# EAGLE design femtoduinoUSB (EAGLE 6.5.0)
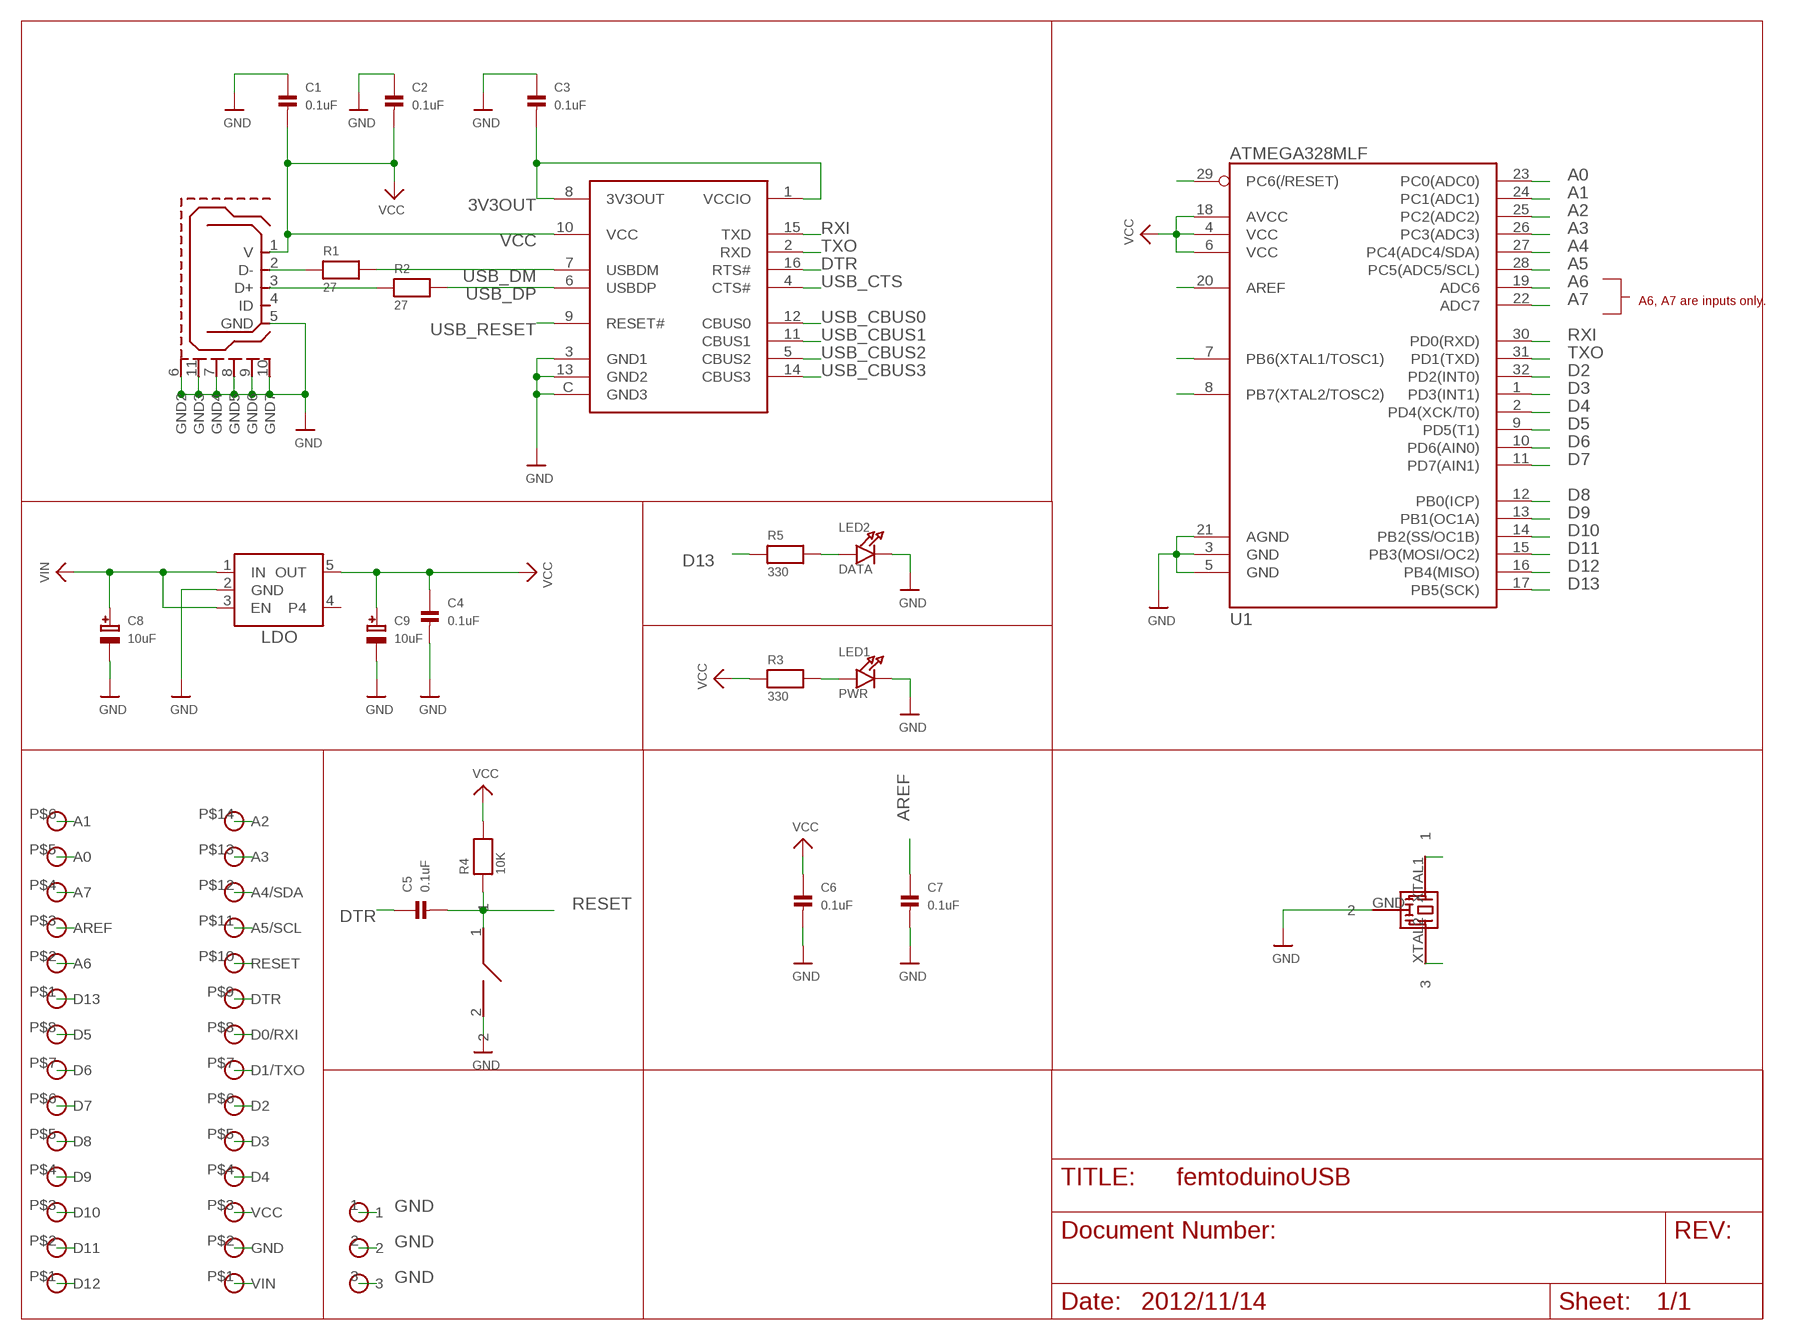
[diagram p0: schematic, sheet 1]
FRAME1 (LETTER_L): LAST_DATE_TIME: 2012/11/14

## Parts
C1  0.1uF  CAP_CERAMIC_0402MP  [_0402MP]
C2  0.1uF  CAP_CERAMIC_0402MP  [_0402MP]
C3  0.1uF  CAP_CERAMIC_0402MP  [_0402MP]
C4  0.1uF  CAP_CERAMIC_0402MP  [_0402MP]
C5  0.1uF  CAP_CERAMIC_0402MP  [_0402MP]
C6  0.1uF  CAP_CERAMIC_0402MP  [_0402MP]
C7  0.1uF  CAP_CERAMIC_0402MP  [_0402MP]
C8  10uF  CAP_TANTALUMA/3216_REFLOW  [EIA3216-18/A-R]
C9  10uF  CAP_TANTALUMA/3216_REFLOW  [EIA3216-18/A-R]
LED1  PWR  LED0603_NOOUTLINE  [CHIPLED_0603_NOOUTLINE]
LED2  DATA  LED0603_NOOUTLINE  [CHIPLED_0603_NOOUTLINE]
R1  27  RESISTOR_0402MP  [_0402MP]
R2  27  RESISTOR_0402MP  [_0402MP]
R3  330  RESISTOR_0402MP  [_0402MP]
R4  10K  RESISTOR_0402  [_0402]
R5  330  RESISTOR_0402MP  [_0402MP]
U1  ATMEGA328MLF  ATMEGA168MLF  [MLF32]
U$1  FT230XQ  [FT230XQ]
U$2  05_PINHEAD_1X6  [05_PINHEAD_1X6_PACKAGE]
U$3  05_PINHEAD_1X8  [05_PINHEAD_1X8_PACKAGE]
U$4  05_PINHEAD_1X14  [05_PINHEAD_1X14_PACKAGE]
U$6  USB_MICROB  [USB_MICROB_PACKAGE]
U$10  LDO_REGULATOR  [LDO_REGULATOR]
U$17  SPST_SMD  [SPST_SMD]
U$22  CSTCE16MOV51-RO  [CSTCE16M0V51-RO_PACKAGE]
U$28  05_PINHEAD_HEADER_1X3  [05_PINHEAD_1X3_HEAD_PACKAGE]

## Nets
3V3OUT: C3.2 U$1.1(VCCIO) U$1.8(3V3OUT)
A0: U1.23(PC0(ADC0)) U$2.P$5(A0)
A1: U1.24(PC1(ADC1)) U$2.P$6(A1)
A2: U1.25(PC2(ADC2)) U$4.P$14(A2)
A3: U1.26(PC3(ADC3)) U$4.P$13(A3)
A4: U1.27(PC4(ADC4/SDA)) U$4.P$12(A4/SDA)
A5: U1.28(PC5(ADC5/SCL)) U$4.P$11(A5/SCL)
A6: U1.19(ADC6) U$2.P$2(A6)
A7: U1.22(ADC7) U$2.P$4(A7)
AREF: C7.1 U1.20(AREF) U$2.P$3(AREF)
D2: U1.32(PD2(INT0)) U$4.P$6(D2)
D3: U1.1(PD3(INT1)) U$4.P$5(D3)
D4: U1.2(PD4(XCK/T0)) U$4.P$4(D4)
D5: U1.9(PD5(T1)) U$3.P$8(D5)
D6: U1.10(PD6(AIN0)) U$3.P$7(D6)
D7: U1.11(PD7(AIN1)) U$3.P$6(D7)
D8: U1.12(PB0(ICP)) U$3.P$5(D8)
D9: U1.13(PB1(OC1A)) U$3.P$4(D9)
D10: U1.14(PB2(SS/OC1B)) U$3.P$3(D10)
D11: U1.15(PB3(MOSI/OC2)) U$3.P$2(D11)
D12: U1.16(PB4(MISO)) U$3.P$1(D12)
D13: R5.1 U1.17(PB5(SCK)) U$2.P$1(D13)
DTR: C5.1 U$1.16(RTS#) U$4.P$9(DTR)
GND: C1.1 C2.1 C3.1 C4.2 C6.2 C7.2 C8.- C9.- LED1.C LED2.C U1.3(GND) U1.5(GND) U1.21(AGND) U$1.3(GND1) U$1.13(GND2) U$1.C(GND3) U$4.P$2(GND) U$6.5(GND) U$6.6(GND2) U$6.7(GND4) U$6.8(GND5) U$6.9(GND6) U$6.10(GND7) U$6.11(GND3) U$10.2(GND) U$17.2 U$22.GND U$28.1 U$28.2 U$28.3
N$1: R1.1 U$6.2(D-)
N$2: R2.1 U$6.3(D+)
N$3: LED2.A R5.2
N$8: LED1.A R3.2
RESET: C5.2 R4.1 U1.29(PC6(/RESET)) U$4.P$10(RESET) U$17.1
RXI: U1.30(PD0(RXD)) U$1.15(TXD) U$4.P$8(D0/RXI)
TXO: U1.31(PD1(TXD)) U$1.2(RXD) U$4.P$7(D1/TXO)
USB_CBUS0: U$1.12(CBUS0)
USB_CBUS1: U$1.11(CBUS1)
USB_CBUS2: U$1.5(CBUS2)
USB_CBUS3: U$1.14(CBUS3)
USB_CTS: U$1.4(CTS#)
USB_DM: R1.2 U$1.7(USBDM)
USB_DP: R2.2 U$1.6(USBDP)
USB_RESET: U$1.9(RESET#)
VCC: C1.2 C2.2 C4.1 C6.1 C9.+ R3.1 R4.2 U1.4(VCC) U1.6(VCC) U1.18(AVCC) U$1.10(VCC) U$4.P$3(VCC) U$6.1(V) U$10.5(OUT)
VIN: C8.+ U$4.P$1(VIN) U$10.1(IN) U$10.3(EN)
XTAL1: U1.7(PB6(XTAL1/TOSC1)) U$22.XTAL1
XTAL2: U1.8(PB7(XTAL2/TOSC2)) U$22.XTAL2
Unconnected: U$6.4(ID) U$10.4

## Notes on the sheet
- A6, A7 are inputs only.

## Library data of the parts
C1-C7 = microbuilder:CAP_CERAMIC: Ceramic Capacitors 0402 - 0402 Surface Mount Capacitors 16pF 50V 5% [Digikey: 445-4899-2-ND] 18pF 50V 5% [Digikey: 490-1281-2-ND] 22pF 50V 5% [Digikey: 490-1283-2-ND] 68pF 50V 5% [Digikey: 490-1289-2-ND] 0.1uF 10V 10% [Digikey: 490-1318-2-ND] 1.0uF 6.3V 10% [Digikey: 490-1320-2-ND] 0603 - 0603 Surface Mount Capacitors 16 pF 50V 5% [Digikey: 445-5051-2-ND] 22 pF 50V [Digikey: PCC220ACVTR-ND] 33 pF 50V 5% [Digikey: 490-1415-1-ND] 56pF 50V 5% [Digikey: 490-1421-1-ND] 220pF 50V 5% [Digikey: 445-1285-1-ND] 680 pF 50V 2200 pF 50V 5% C0G [Digikey: 445-1297-1-ND] 5600 pF 100V 5% X7R [Digikey: 478-3711-1-ND] 0.1 µF 25V 10% [Digikey: PCC2277TR-ND] 0.22 µF 16V 10% X7R [Digikey: 445-1318-1-ND] 1.0 µF 25V 10% [Digikey: 445-5146-2-ND] 0603 - RF Specific 3pF 250V +/-0.1pF RF [Digikey: 712-1347-1-ND] 18 pF 250V 5% [Digikey: 478-3505-1-ND or 712-1322-1-ND] 56 pF 250V 5% C0G RF [Digikey: 490-4867-1-ND] 68 pF 250V RF [Digikey: 490-4868-1-ND] 0805 - 0805 Surface Mount Capacitors 220 pF 250V 2% RF Ceramic Capacitor [Digikey: 712-1398-1-ND] 1000 pF 50V 2% NP0 Ceramic Capacitor [Digikey: 478-3760-1-ND] 0.1 µF 25V 10% Ceramic Capacitor [Digikey: PCC1828TR-ND] 1.0 µF 16V 10% Ceramic Capacitor[Digikey: 490-1691-2-ND] 10.0 µF 10V 10% Ceramic Capacitor[Digikey: 709-1228-1-ND] 10.0 uF 16V 10% Ceramic Capacitor [Digikey: 478-5165-2-ND] 47 uF 6.3V 20% Ceramic Capacitor [Digikey: 587-1779-1-ND or 399-5506-1-ND] 1206 - 1206 Surface Mount Capacitors 47uF 10V 20% Ceramic Capacitor [Digikey: 490-5528-1-ND or 399-5508-1-ND or 445-6010-1-ND] 100uF 6.3V -20%, +80% Y5V Ceramic Capacitor (Digikey: 490-4512-1-ND, Mouser: 81-GRM31CF50J107ZE1L)
C8 C9 = microbuilder:CAP_TANTALUM: Tantalum Capacitors Wave footprints have larger pads and are meant to be used for hand soldering. Reflow footprints are optimised for solder paste and a reflow oven. EIA3216-18/A-[R/W] - Size A / 3216-18 / 1206 footprint 4.7µF 25V 10% Tantalum Capacitor 10µF 16V 10% Tantalum Capacitor [Digikey: 495-2236-2-ND] EIA3528-21/B-[R/W] - Size B / 3528-21 47µF 10V 10% Tantalum Capactior [Digikey: 495-2216-1-ND] EIA6032-28/C-[R/W] - Size C / 6032-28 10µF 35V 20% Tantalum Capacitor [Digikey: 495-2285-1-ND] 100µF 16V 10% Tantalum Capactior [Digikey: 399-5214-1-ND]
LED1 LED2 = microbuilder:LED: LED 0603 - 0603 Surface Mount Package 2mA: Green LED - Low Power (3.9mcd, 2ma, 1.7Vf) - Digikey: 475-2709-2-ND Orange LED - Low Power (9.8mcd, 2ma, 1.8Vf) - Digikey: 475-1194-2-ND Red LED - Low Power (5mcd, 2ma, 1.8Vf) - Digikey: 475-1195-2-ND Yellow LED - Low Power (7mcd, 2ma, 1.8Vf) - Digikey: 475-1196-2-ND 5mA: Blue LED - Low Power (17mcd, 5ma, 2.9Vf) - Digikey: LNJ937W8CRACT-ND 0805 - 0805 Surface Mount Package 2mA: Red LED (8.8mcd, 2mA, 1.8Vf, Clear) - Low Power [Digikey: 475-2510-1-ND] Green LED (5mcd, 2mA, 1.8Vf, Clear) - Low Power [Digikey: 475-2730-1-ND] Yellow LED (11.3mcd, 2mA, 1.8Vf, Clear) - Low Power [Digikey: 475-2555-1-ND] 20mA: Red LED (104mcd, 20mA, Diffused) - LS R976 [Digikey: 475-1278-6-ND] Red LED (12mcd, 20mA, 2.0Vf, Clear) - APT2012EC [Digikey: 754-1128-1-ND] Green LED (15mcd, 20mA, 2.2Vf, Clear) - APT2012GC [Digikey: 754-1131-1-ND] Orange LED (160mcd, 20mA, 2.1Vf, Clear) - APT2012SECK [Digikey: 754-1130-1-ND] 1206 - 1206 Surface Mount Package Green LED (26mcd, 20mA, Diffused) - LG N971 [Digikey: 475-1407-6-ND] Red LED (15mcd, 20mA, Diffused) - LH N974 [Digikey: 475-1416-6-ND]
R1-R5 = microbuilder:RESISTOR: Resistors 0402 - 0402 Surface Mount Package 22 Ohm 1% 1/16W [Digikey: 311-22.0LRTR-ND] 33 Ohm 5% 1/16W 1.0K 5% 1/16W 1.5K 5% 1/16W 2.0K 1% 1/16W 10.0K 1% 1/16W [Digikey: 311-10.0KLRTR-ND] 10.0K 5% 1/16W [Digikey: RMCF0402JT10K0TR-ND] 12.1K 1% 1/16W [Digikey: 311-22.0LRTR-ND] 100.0K 5% 1/16W 0603 - 0603 Surface Mount Package 0 Ohm 1/10 Watt 1% Resistor 15 Ohm 1/10 Watt 1% Resistor 33 Ohm 1/10 Watt 1% Resistor 49.9 Ohm 1/10 Watt 1% Resistor 100 Ohm 1/10 Watt 1% Resistor 150 Ohm 1/10 Watt 1% Resistor 240 Ohm 1/10 Watt 1% Resistor 390 Ohm 1/10 Watt 1% Resistor 560 Ohm 1/10 Watt 1% Resistor 680 Ohm 1/10 Watt 1% Resistor 750 Ohm 1/10 Watt 1% Resistor 1.0K Ohm 1/10 Watt 1% Resistor 1.5K Ohm 1/10 Watt 1% Resistor 2.0K Ohm 1/10 Watt 1% Resistor 2.2K Ohm 1/10 Watt 1% Resistor 3.3K Ohm 1/10 Watt 1% Resistor 4.7K Ohm 1/10 Watt 1% Resistor 10.0K Ohm 1/10 Watt 1% Resistor 12.0K Ohm 1/10 Watt 1% Resistor 12.1K Ohm 1/10 Watt 1% Resistor 20.0K Ohm 1/10 Watt 1% Resistor 33.0K Ohm 1/10 Watt 1% Resistor 100.0K Ohm 1/10 Watt 1% Resistor 0805 - 0805 Surface Mount Package 0 Ohm 1/8 Watt 1% Resistor 33 Ohm 1/8 Watt 1% Resistor 100 Ohm 1/8 Watt 1% Resistor 150 Ohm 1/8 Watt 1% Resistor 200 Ohm 1/8 Watt 1% Resistor 240 Ohm 1/8 Watt 1% Resistor 330 Ohm 1/8 Watt 1% Resistor 390 Ohm 1/8 Watt 1% Resistor 470 Ohm 1/8 Watt 1% Resistor 1.0K Ohm 1/8 Watt 1% Resistor 1.5K Ohm 1/8 Watt 1% Resistor 2.0K Ohm 1/8 Watt 1% Resistor 4.7K Ohm 1/8 Watt 1% Resistor 5.1K Ohm 1/8 Watt 1% Resistor 5.6K Ohm 1/8 Watt 1% Resistor 10.0K Ohm 1/8 Watt 1% Resistor 22.0K Ohm 1/8 Watt 1% Resistor 33.0K Ohm 1/8 Watt 1% Resistor 100K Ohm 1/8 Watt 1% Resistor 1206 - 1206 Surface Mount Package 2012 - 2010 Surface Mount Package 0.11 Ohm 1/2 Watt 1% Resistor - Digikey: RHM.11UCT-ND
U1 = SparkFun-DigitalIC:ATMEGA168: Atmel 32-pin 8-bit micro, 16k flash.
U$1 = femtoduino:FT230XQ
U$2 = femtoduino:05_PINHEAD_1X6
U$3 = femtoduino:05_PINHEAD_1X8
U$4 = femtoduino:05_PINHEAD_1X14
U$6 = femtoduino:USB_MICROB: This is the hirose ZX62-B-5PA(11) MICRO-USB B Type female connection.
U$10 = femtoduino:LDO_REGULATOR
U$17 = femtoduino:SPST_SMD
U$22 = femtoduino:CSTCE16MOV51-RO: This is the CSTCE16M0V51-R0 Murata resonator (CERALOCK) 16Mhz 0.5% Tolerance
U$28 = femtoduino:05_PINHEAD_HEADER_1X3

## Net classes
0 default: clearance 0.205 mm

## Board
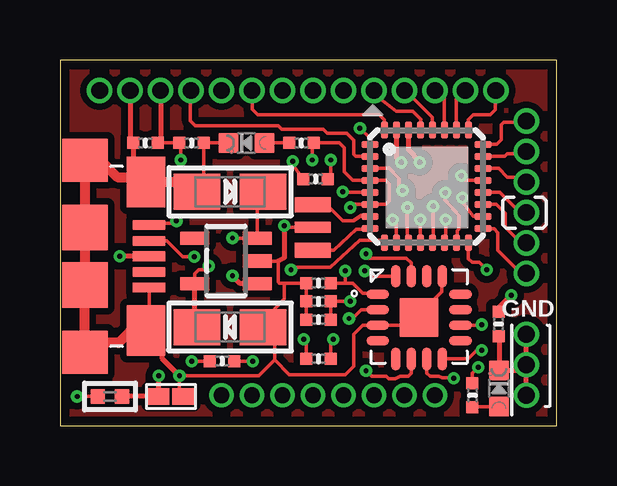
[diagram p1: board, top side]
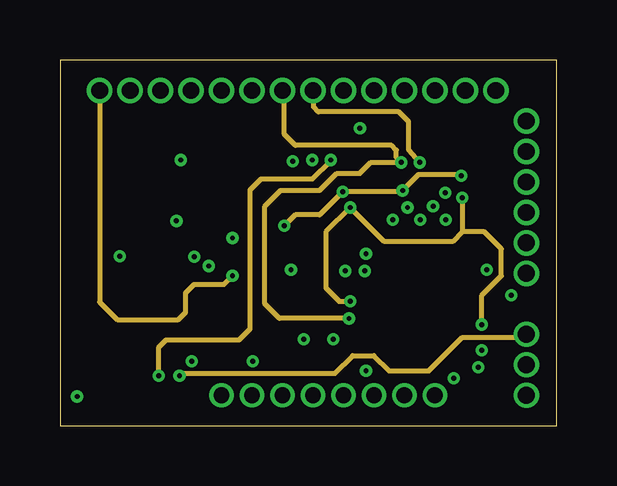
[diagram p2: board, inner layer Route2]
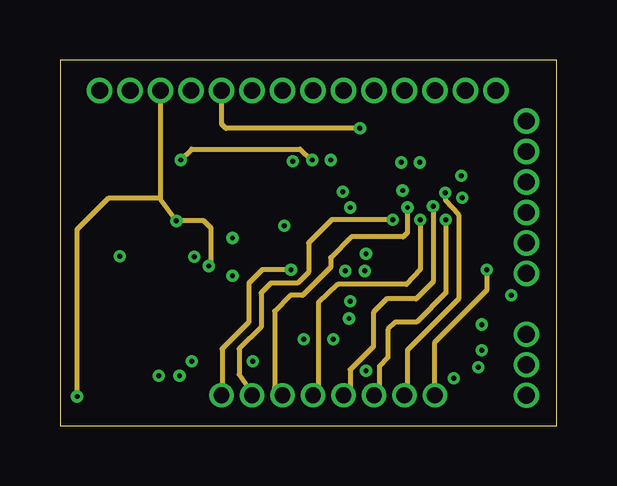
[diagram p3: board, inner layer Route15]
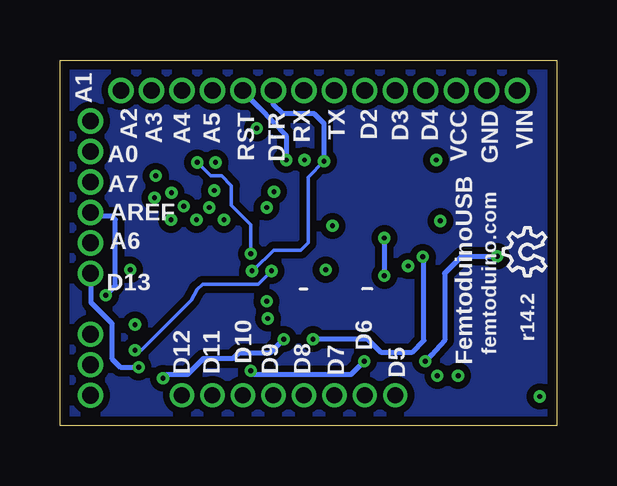
[diagram p4: board, bottom side, seen from below]

Size 20.7 x 15.24 mm. Coordinates in mm from the lower left corner, seen from the top.
Outline: 0,0 20.7,0 20.7,15.24 0,15.24 0,0
Copper layers (1+2*15+16): Top 0.035mm / dielectric 0.7mm / Route2 0.035mm / dielectric 0.15mm / Route15 0.035mm / dielectric 0.2mm / Bottom 0.035mm
Design rules "AQS_custom_4layer *": minimum track width 5mil, minimum drill 5mil, track to track 5mil, track to pad 5mil, pad to pad 5mil, via to via 5mil, smd to smd 1mil, copper to edge 15mil, drill to drill 6mil, minimum pad ring 7mil, minimum via ring 3mil, stop-mask expansion 2mil, vias tented up to drill 10mil, thermal gap 10mil

### Footprints (pad centres in the part's own frame; a part is rotated, then mirrored left to right if it is on the bottom)
_0402MP = smd 0.5 x 0.5: 1 -0.508,0; 2 0.508,0
EIA3216-18/A-R = smd 1.95 x 1.5: + 1.375,0; - -1.375,0
CHIPLED_0603_NOOUTLINE = smd 0.8 x 0.8: A 0,-0.75; C 0,0.75
_0402 = smd 0.6 x 0.6: 1 -0.508,0; 2 0.508,0
MLF32 = smd 0.7 x 0.3: 1 -2.35,1.75; 2 -2.35,1.25; 3 -2.35,0.75; 4 -2.35,0.25; 5 -2.35,-0.25; 6 -2.35,-0.75; 7 -2.35,-1.25; 8 -2.35,-1.75; 17 2.35,-1.75; 18 2.35,-1.25; 19 2.35,-0.75; 20 2.35,-0.25; 21 2.35,0.25; 22 2.35,0.75; 23 2.35,1.25; 24 2.35,1.75 | smd 0.3 x 0.7: 9 -1.75,-2.35; 10 -1.25,-2.35; 11 -0.75,-2.35; 12 -0.25,-2.35; 13 0.25,-2.35; 14 0.75,-2.35; 15 1.25,-2.35; 16 1.75,-2.35; 25 1.75,2.35; 26 1.25,2.35; 27 0.75,2.35; 28 0.25,2.35; 29 -0.25,2.35; 30 -0.75,2.35; 31 -1.25,2.35; 32 -1.75,2.35
FT230XQ = smd 0.95 x 0.4: 1 -1.725,0.975; 2 -1.725,0.325; 3 -1.725,-0.325; 4 -1.725,-0.975; 9 1.725,-0.975; 10 1.725,-0.325; 11 1.725,0.325; 12 1.725,0.975 | smd 0.4 x 0.95: 5 -0.975,-1.725; 6 -0.325,-1.725; 7 0.325,-1.725; 8 0.975,-1.725; 13 0.975,1.725; 14 0.325,1.725; 15 -0.325,1.725; 16 -0.975,1.725 | smd 1.6 x 1.6: C 0,0
05_PINHEAD_1X6_PACKAGE = drill 0.7 pad 1.016: P$1 0,0; P$2 0,1.27; P$3 0,2.54; P$4 0,3.81; P$5 0,5.08; P$6 0,6.35
05_PINHEAD_1X8_PACKAGE = drill 0.66 pad 1.016: P$1 0,0; P$2 0,1.27; P$3 0,2.54; P$4 0,3.81; P$5 0,5.08; P$6 0,6.35; P$7 0,7.62; P$8 0,8.89
05_PINHEAD_1X14_PACKAGE = drill 0.7 pad 1.016: P$1 0,0; P$2 0,1.27; P$3 0,2.54; P$4 0,3.81; P$5 0,5.08; P$6 0,6.35; P$7 0,7.62; P$8 0,8.89; P$9 0,10.16; P$10 0,11.43; P$11 0,12.7; P$12 0,13.97; P$13 0,15.24; P$14 0,16.51
USB_MICROB_PACKAGE = smd 0.4 x 1.35: 1 -1.3,1.47; 2 -0.64,1.47; 3 0,1.47; 4 0.66,1.47; 5 1.3,1.47 | smd 2.1 x 1.6: 6 -3.1,1.35; 11 3.1,1.35 | smd 1.8 x 1.9: 7 -4,-1.2; 10 4,-1.2 | smd 1.9 x 1.9: 8 -1.2,-1.2; 9 1.2,-1.2
LDO_REGULATOR = smd 0.55 x 1.2: 1 -0.95,-1.3; 2 0,-1.3; 3 0.95,-1.3; 4 0.95,1.3; 5 -0.95,1.3
SPST_SMD = smd 0.889 x 0.699: 1 -0.508,0; 2 0.508,0
CSTCE16M0V51-RO_PACKAGE = smd 1.5 x 0.45: GND 0,0 | smd 1.5 x 0.62: XTAL1 0,0.95; XTAL2 0,-0.95
05_PINHEAD_1X3_HEAD_PACKAGE = drill 0.7 pad 1.016: 1 0,0; 2 0,-1.27; 3 0,-2.54

### Placement (x,y rotation side)
C1  10.77,4.42 0 top
C2  10.77,5.18 0 top
C3  10.77,5.94 0 top
C4  5.49,11.79 0 top
C5  10.65,10.28 0 top
C6  3.56,11.79 180 top
C7  18.27,4.24 270 top
C8  7.09,9.75 0 top
C9  7.09,4.11 180 top
LED1  7.77,11.79 90 top
LED2  18.29,1.55 0 top
R1  10.77,2.79 0 top
R2  6.76,2.69 0 top
R3  10.06,11.79 180 top
R4  2.08,1.22 180 top
R5  17.18,1.27 270 top
U1  15.27,9.97 0 top
U$1  14.96,4.51 0 top
U$2  19.43,6.35 0 top
U$3  15.62,1.27 90 top
U$4  1.65,13.97 270 top
U$6  2.24,7.06 270 top
U$10  6.92,6.87 90 top
U$17  4.62,1.22 0 top
U$22  10.54,8.27 0 top
U$28  19.43,1.27 180 top
U$29  [OSHW_6X70_NOTEXT]  0.46,6.26 90 bottom

### Tracks (layer width: path | path; a pad name or v marks a point on that pad's centre or on a via)
3V3OUT  (via drill 0.2 pad 0.51)
  Top 0.127: 13.23,5.51 U$1.1
  Top 0.14: U$1.8 17.01,2.78 17.37,3.15 v17.58,3.15 | 13.23,5.51 12.62,5.51 12.19,5.94 11.89,5.94 | C3.2 11.89,5.94 | v11.89,6.45 11.89,5.94
  Bottom 0.152: v17.58,3.15 17.32,3.15 15.24,5.23 14.99,5.69 14.76,5.89 12.45,5.89 v11.89,6.45
A0
  Top 0.14: U1.23 18.54,11.22 18.64,11.33 19.33,11.33 U$2.P$5
A1
  Top 0.14: U1.24 18.2,11.72 18.39,11.91 18.39,12.55 18.49,12.65 19.38,12.65 U$2.P$6
A2
  Top 0.14: U1.25 17.02,12.75 17.22,12.95 17.93,12.95 18.14,13.16 18.14,13.95 U$4.P$14
A3
  Top 0.14: U1.26 16.52,13.6 U$4.P$13
A4
  Top 0.14: U1.27 16.02,13.67 U$4.P$12
A5
  Top 0.14: U1.28 15.52,12.85 14.43,13.95 U$4.P$11
A6
  Top 0.14: U1.19 18.19,9.22 18.54,8.87 18.54,8.28 19.2,7.62 U$2.P$2
A7
  Top 0.14: U1.22 18.29,10.72 18.64,10.36 19.23,10.36 U$2.P$4
AREF  (via drill 0.2 pad 0.51)
  Top 0.14: U$2.P$3 19.15,8.89 18.32,9.72 U1.20
  Top 0.152: C7.1 18.27,4.91
  Top 0.203: 18.27,4.91 v18.8,5.44
  Bottom 0.203: v18.8,5.44 18.39,5.84 18.39,8.59 18.54,8.74 19.28,8.74 U$2.P$3
D2
  Top 0.14: U$4.P$6 8,13.18 8.23,12.95 13.31,12.95 13.52,12.74 U1.32
  Top 0.152: U1.32 13.51,12.25
D3  (via drill 0.2 pad 0.51)
  Top 0.14: U1.1 12.92,11.97 v12.5,12.39
  Route15 0.203: v12.5,12.39 6.91,12.39 6.73,12.57 U$4.P$5
D4
  Top 0.152: U1.2 12.32,11.22 12.24,11.3 12.24,11.89 11.94,12.19 11.12,12.19 10.97,12.34 9.25,12.34 9.09,12.5 5.64,12.5 5.44,12.7 5.44,13.95 U$4.P$4
D5  (via drill 0.2 pad 0.51)
  Top 0.14: U1.9 13.54,7.54 13.46,7.72 12.5,7.72 11.25,6.6 9.75,6.6 v9.63,6.5
  Route15 0.203: v9.63,6.5 8.43,6.5 7.87,5.94 7.87,4.32 6.76,3.2 6.76,1.5 U$3.P$8
D6  (via drill 0.2 pad 0.51)
  Top 0.14: U1.10 14.02,8.48 v13.87,8.59
  Route15 0.203: v13.87,8.59 11.33,8.59 10.36,7.62 10.36,6.4 9.91,5.94 8.79,5.94 8.38,5.54 8.38,4.12 7.47,3.2 7.47,2.13 8,1.35 U$3.P$7
D7  (via drill 0.2 pad 0.51)
  Top 0.14: v14.48,9.09 14.48,7.59 U1.11
  Route15 0.203: v14.48,9.09 14.48,8.05 14.3,7.87 12.14,7.87 11.28,7.01 11.28,6.6 10.11,5.44 9.6,5.44 8.94,4.78 8.94,1.6 U$3.P$6
D8  (via drill 0.2 pad 0.51)
  Top 0.14: v15.01,8.59 15.01,7.55 U1.12
  Route15 0.203: v15.01,8.59 15.01,6.53 14.43,5.89 11.58,5.89 10.77,5.13 10.77,1.5 U$3.P$5
D9  (via drill 0.2 pad 0.51)
  Top 0.14: v15.54,9.14 15.54,7.57 U1.13
  Route15 0.203: v15.54,9.14 15.54,5.99 14.83,5.28 13.61,5.28 13.06,4.72 13.06,3.3 12.09,2.34 12.09,1.55 U$3.P$4
D10  (via drill 0.2 pad 0.51)
  Top 0.14: v16.08,8.59 16.08,7.6 U1.14
  Route15 0.203: v16.08,8.59 16.08,5.54 14.86,4.32 13.97,4.32 13.66,4.01 13.66,2.85 13.31,2.49 13.31,1.5 U$3.P$3
D11  (via drill 0.2 pad 0.51)
  Top 0.127: 16.57,7.59 U1.15
  Top 0.14: v16.05,9.7 16.05,9.4 16.62,8.78 16.62,8.19 16.56,8.13 16.56,7.58
  Top 0.152: 16.56,7.58 U1.15
  Route15 0.203: v16.05,9.7 16.05,9.4 16.61,8.79 16.61,5.28 14.48,3.15 14.48,1.4 U$3.P$2
D12  (via drill 0.2 pad 0.51)
  Top 0.14: U1.16 17.02,6.96 17.17,6.81 17.48,6.81 v17.78,6.5
  Route15 0.127: 15.6,1.29 U$3.P$1
  Route15 0.203: v17.78,6.5 17.78,5.64 15.6,3.45 15.6,1.29
D13  (via drill 0.2 pad 0.51)
  Top 0.14: 18.09,8.2 18.24,8.05 18.24,7.32 19.2,6.35 U$2.P$1 | v17.42,2.44 17.18,2.2 R5.1
  Top 0.152: U1.17 17.64,8.2 18.09,8.2
  Bottom 0.203: v17.42,2.44 18.19,2.44 18.54,2.79 18.54,4.27 19.41,5.13 19.41,6.33 U$2.P$1
DTR  (via drill 0.2 pad 0.51)
  Top 0.14: C5.1 9.7,10.88 v9.7,11.02
  Top 0.152: U$1.16 12.97,6.23 v12.7,6.45
  Bottom 0.152: v9.7,11.02 10.36,10.36 10.36,7.62 10.67,7.32 11.79,7.32 12.04,7.06 v12.7,6.45
  Bottom 0.203: U$4.P$9 11.81,13.39 11.43,13.01 10.11,13.01 9.7,12.6 v9.7,11.02
GND  (via drill 0.2 pad 0.51)
  Top 0.127: 1.43,3.45 U$6.10 | 3.39,10.36 U$6.6 | 4.98,1.37 U$17.2 | U$1.C 14.96,4.65 | 15.9,6.22 U$1.13 | 2.92,11.91 C6.2
  Top 0.14: 3.05,10.7 U$6.6 | U$22.GND 9.54,8.27 v9.35,8.33 | C1.1 C2.1 C3.1 9.35,5.94 9.14,5.94 9.09,5.99 9.09,6.86 | 8.94,2.74 9.55,2.13 11.89,2.13 12.24,2.49 12.24,3.81 12.62,4.18 U$1.3 14.61,4.18 U$1.C | 14.96,4.65 15.9,5.59 15.9,6.22 | U1.5 11.84,9.72 v11.79,9.75 | U1.3 13.71,10.72 14.12,10.31 14.12,9.91 v14.28,9.8 | U1.21 16.86,10.22 v16.71,10.41
  Top 0.152: U$6.5 3.71,4.08 U$6.11 | 5.33,10.16 C8.- 5.99,10.01 C4.2 LED1.C | C9.- 8.28,4.06 | 9.09,6.86 8.23,6.86 U$10.2 | 8.94,4.02 8.94,2.74 8.28,2.08 v4.98,2.08 4.98,1.37 | 8.94,4.02 C9.- | 18.3,3.7 C7.2 | 8.38,4.06 C9.- | 8.94,4.02 8.94,4.88 9.35,5.28 9.35,5.94
  Top 0.203: C6.2 3.05,10.7 | v9.35,8.33 9.35,7.01 9.09,6.86 | U$4.P$2 2.92,11.91 | 18.3,3.7 18.3,2.31 | 18.3,2.31 LED2.C | 18.3,2.31 19.2,2.31 U$28.2 | U$28.2 U$28.3 | U$28.1 U$28.2 | v4.98,2.08 4.27,2.79 4.27,3.28 U$6.11
  Top 0.406: U$6.10 U$6.9 U$6.8 U$6.7 1.69,11.06 2.39,10.36 3.39,10.36 | U$6.11 2.94,3.96 2.44,3.45 1.43,3.45 | U$6.6 5.33,10.16
  Route2 0.127: v14.28,9.8 14.22,9.75
  Route2 0.203: 14.22,9.75 v11.79,9.75 10.82,8.79 9.8,8.79 v9.35,8.33 | v16.71,10.41 16.71,10.46 14.94,10.46 v14.28,9.8 | U$28.3 19.3,3.68 16.76,3.68 15.37,2.29 13.72,2.29 13.08,2.92 12.19,2.92 11.46,2.18 5.08,2.18 v4.98,2.08
N$1  (via drill 0.2 pad 0.51)
  Top 0.14: R1.1 10.26,3.5 v10.16,3.61
  Top 0.152: U$6.2 4.44,7.7 5.11,7.04 v5.59,7.04
  Bottom 0.203: v10.16,3.61 7.87,3.61 7.32,3.05 6.04,3.05 5.54,3.56 5.54,6.99 v5.59,7.04
N$2  (via drill 0.2 pad 0.51)
  Top 0.14: R2.1 v5.49,2.69
  Top 0.203: U$6.3 v2.49,7.06
  Bottom 0.203: v5.49,2.69 5.23,2.95 4.67,3.56 4.67,6.35 3.96,7.06 v2.49,7.06
N$3
  Top 0.14: 17.35,0.79 18.28,0.79
  Top 0.152: R5.2 17.35,0.79 | 18.28,0.79 LED2.A
N$4
  pour Bottom (isolate 0.279): 0.25,14.99 20.32,14.99 20.32,0.25 0.25,0.25
  pour Top (isolate 0.279): 0.25,14.99 20.32,14.99 20.32,0.25 0.25,0.25
N$8
  Top 0.14: LED1.A R3.2
RESET  (via drill 0.2 pad 0.51)
  Top 0.14: v11.28,11.07 11.28,10.35 C5.2 | 15.04,12.78 14.71,13.11 14.02,13.11 13.08,13.84 U$4.P$10
  Top 0.152: U1.29 15.04,12.26 15.04,12.78
  Top 0.203: v4.12,2.08 U$17.1 R4.1
  Route2 0.127: v4.12,2.08 4.12,2.13
  Route2 0.203: 4.12,2.13 4.12,3.28 4.42,3.58 7.47,3.58 7.92,4.04 7.92,9.83 8.38,10.29 10.52,10.29 11.28,11.05 v11.28,11.07
  Bottom 0.203: v11.28,11.07 11.28,12.09 12.39,13.26 13.08,13.95 U$4.P$10
RXI  (via drill 0.2 pad 0.51)
  Top 0.14: U$1.15 14.64,6.8 14.43,6.99 12.75,6.99 v12.75,7.16
  Top 0.203: U1.30 14.52,11.51 v14.99,10.97
  Route2 0.127: 10.57,13.95 U$4.P$8
  Route2 0.203: v14.99,10.97 14.53,11.51 14.53,12.68 14.12,13.08 10.77,13.08 10.57,13.28 10.57,13.95
  Bottom 0.152: v12.75,7.16 12.75,8.38 13.56,9.2 13.56,10.01 13.97,10.41 14.43,10.41 v14.99,10.97
TXO  (via drill 0.2 pad 0.51)
  Top 0.14: U$1.2 12.55,4.83 12.19,4.47 v12.04,4.47
  Top 0.203: U1.31 14.02,11.18 v14.22,10.97
  Route2 0.203: U$4.P$7 9.35,13.89 9.35,12.14 9.8,11.68 13.82,11.68 14.02,11.48 14.02,11.18 v14.22,10.97 12.95,10.97 12.5,10.52 11.53,10.52 10.82,9.8 9.2,9.8 8.53,9.14 8.53,5.08 9.14,4.47 v12.04,4.47
USB_DM  (via drill 0.2 pad 0.51)
  Top 0.14: R1.2 11.28,3.5 v11.38,3.61 | v16.41,1.98 16.38,2.01 15.93,2.01 15.77,2.06 15.42,2.06 15.29,2.18 U$1.7
  Top 0.152: U$1.7
  Bottom 0.203: v16.41,1.98 16.26,2.13 15.39,2.13 14.73,2.79 13.51,2.79 13.26,3.05 11.94,3.05 v11.38,3.61
USB_DP  (via drill 0.2 pad 0.51)
  Top 0.14: R2.2 v8.03,2.69 | U$1.6 14.64,2.19 14.5,2.06 14.17,2.06 13.97,1.96 13.69,1.96 13.59,2.06 12.98,2.06 v12.75,2.29
  Bottom 0.203: v8.03,2.69 8.59,2.13 12.6,2.13 v12.75,2.29
VCC  (via drill 0.2 pad 0.51)
  Top 0.14: C6.1 C4.1 | 3.78,8.43 4.67,8.43 4.78,8.53 v4.85,8.53 | 5.03,11.73 v5.03,11.07 | R3.1 11.63,11.79 11.84,11.58 11.84,10.59 12.21,10.22 U1.4 13.58,10.22 13.72,10.08 13.72,9.37 13.56,9.22 U1.6 12.22,9.22 v12.09,9.09 | C1.2 C2.2 v12.09,5.18 | U1.18 17.21,8.72 16.82,9.25 | v6.2,6.66 6.04,6.5 5.79,6.5 5.62,6.33 U$10.5 | 10.52,11.73 v10.52,11.07
  Top 0.152: 4.19,11.91 C6.1 | U$6.1 3.78,8.43 | R4.2 v0.71,1.22 | C4.1 5.03,11.73 | 16.82,9.25 16.82,9.4 v16.76,9.5 | U$1.10 17.57,4.18 v17.58,4.22 | R3.1 10.52,11.73
  Top 0.203: U$4.P$3 4.19,11.91 | C9.+ 5.62,4.23 U$10.5
  Route2 0.203: v12.09,5.18 11.63,5.18 11.07,5.74 11.07,8.08 v12.09,9.09 13.51,7.67 16.36,7.67 16.76,8.08 | v16.76,9.5 16.76,8.08 | v17.58,4.22 17.58,5.44 18.39,6.25 18.39,7.37 17.68,8.08 16.76,8.08
  Route15 0.127: 4.19,9.42 4.19,9.5 | 10.46,11.07 v10.52,11.07
  Route15 0.203: 4.19,9.42 v4.85,8.53 5.99,8.53 6.3,8.23 6.3,6.81 v6.2,6.66 | U$4.P$3 4.19,9.5 2.03,9.5 0.71,8.18 v0.71,1.22 | v5.03,11.07 5.49,11.53 10.01,11.53 10.46,11.07
VIN  (via drill 0.2 pad 0.51)
  Top 0.152: v7.19,7.82 U$10.3 8.22,9.51
  Top 0.203: U$10.1 7.52,5.92 v7.19,6.25 | 8.22,9.51 C8.+
  Route2 0.203: U$4.P$1 1.65,5.16 2.39,4.42 4.93,4.42 5.23,4.72 5.23,5.54 5.59,5.89 6.83,5.89 v7.19,6.25
  Bottom 0.203: v7.19,7.82 v7.19,6.25
XTAL1
  Top 0.14: U$22.XTAL1 11.26,9.06 11.79,8.53 12.22,8.53 12.57,8.76 12.86,8.76 U1.7 13.08,8.74
XTAL2
  Top 0.14: U$22.XTAL2 11.4,7.32 12.34,8.18 12.85,8.18 U1.8

### Text on the board
tNames: GND
bNames: A1 | VIN | GND | VCC | D4 | D3 | D2 | TX | RX | DTR | RST | A5 | A4 | A3 | A2 | A0 | A7 | AREF | A6 | D13 | r14.2 | femtoduino.com | FemtoduinoUSB | D6 | D10 | D5 | D7 | D8 | D9 | D11 | D12